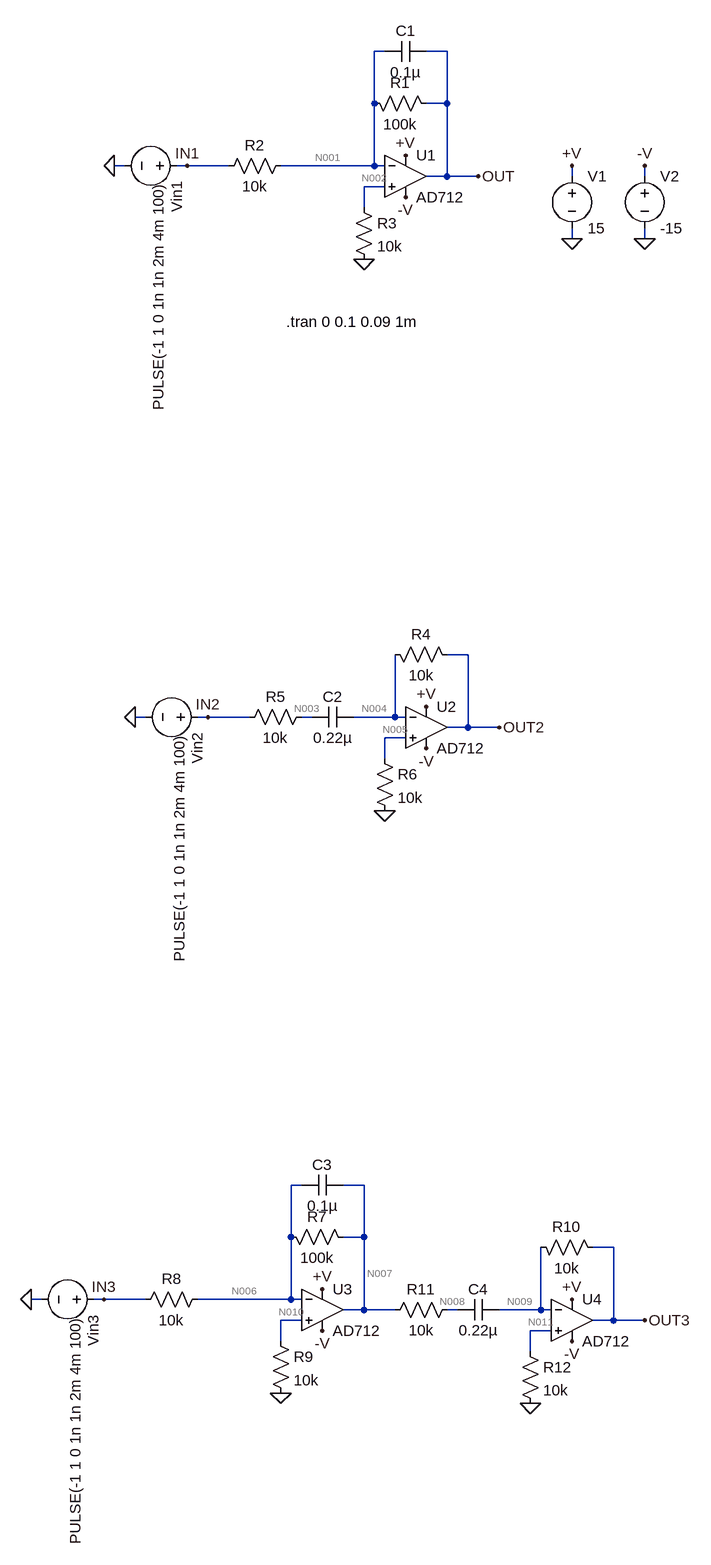
[diagram p0: schematic DICircuit.asc]
* DICircuit.asc
Vin1 IN1 0 PULSE(-1 1 0 1n 1n 2m 4m 100)
* U1: AD712 (symbol AD712 not available, pins judged from their places): In+=N002 In-=N001 V+=+V V-=-V OUT=OUT
R1 N001 OUT 100k
R2 N001 IN1 10k
R3 N002 0 10k
V1 +V 0 15
V2 -V 0 -15
C1 OUT N001 0.1µ
* U2: AD712 (symbol AD712 not available, pins judged from their places): In+=N005 In-=N004 V+=+V V-=-V OUT=OUT2
R4 N004 OUT2 10k
R5 N003 IN2 10k
R6 N005 0 10k
C2 N004 N003 0.22µ
* U3: AD712 (symbol AD712 not available, pins judged from their places): In+=N010 In-=N006 V+=+V V-=-V OUT=N007
R7 N006 N007 100k
R8 N006 IN3 10k
R9 N010 0 10k
C3 N007 N006 0.1µ
* U4: AD712 (symbol AD712 not available, pins judged from their places): In+=N011 In-=N009 V+=+V V-=-V OUT=OUT3
R10 N009 OUT3 10k
R11 N008 N007 10k
R12 N011 0 10k
C4 N009 N008 0.22µ
Vin2 IN2 0 PULSE(-1 1 0 1n 1n 2m 4m 100)
Vin3 IN3 0 PULSE(-1 1 0 1n 1n 2m 4m 100)
.tran 0 0.1 0.09 1m
.backanno
.end

* Results of the author's LTspice run, read from the files saved beside the schematic
* Operating Point, zero values left out:
*   V(n002) = -250 nV
*   V(+v) = 15 V
*   V(-v) = -15 V
*   V(n005) = -250 nV
*   V(n003) = -1 V
*   V(n010) = -250 nV
*   V(n006) = -17.4 µV
*   V(in3) = -1 V
*   V(in1) = -1 V
*   V(n001) = -17.4 µV
*   V(out) = 10 V
*   V(n004) = -250 nV
*   V(in2) = -1 V
*   V(n007) = 10 V
*   V(n011) = -250 nV
*   V(n009) = -250 nV
*   V(n008) = 10 V
*   I(Vin1) = 100 µA
*   I(R3) = -25 pA
*   I(R4) = -25 pA
*   I(R6) = -25 pA
*   I(R7) = -100 µA
*   I(R9) = -25 pA
*   I(R10) = -25 pA
*   I(R12) = -25 pA
*   I(Vin3) = 100 µA
*   I(R1) = -100 µA
*   I(R2) = 100 µA
*   I(V1) = -19.7 mA
*   I(R8) = 100 µA
*   I(V2) = 19.5 mA
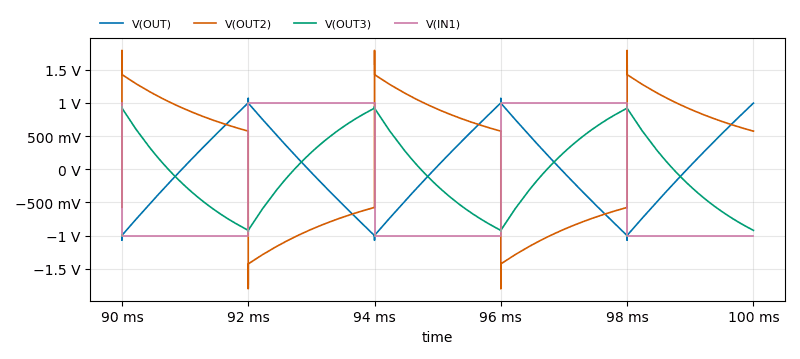
[diagram p1: Transient Analysis of DICircuit.asc, plotted from the saved traces]
* Transient Analysis, 1 run:
*   V(OUT): min -1.069 V, max 1.071 V, average 7.226 mV, rms 578.8 mV, last 997 mV
*   V(OUT2): min -1.8 V, max 1.791 V, average 187.6 mV, rms 968.6 mV, last 574.4 mV
*   V(OUT3): min -946.1 mV, max 949.4 mV, average -33 mV, rms 558.1 mV, last -919.2 mV
*   V(IN1): min -1 V, max 1 V, average -200 mV, rms 1 V, last -1 V